# Altium schematic sheet TopLevel.SchDoc
size B; Engineer: Joe H.; DocumentNumber: 000169-501; Revision: 02; SheetNumber: 1; SheetTotal: 1; ProjectTitle: Quick Fire TK USB-C; Reviewer1: Luke C.
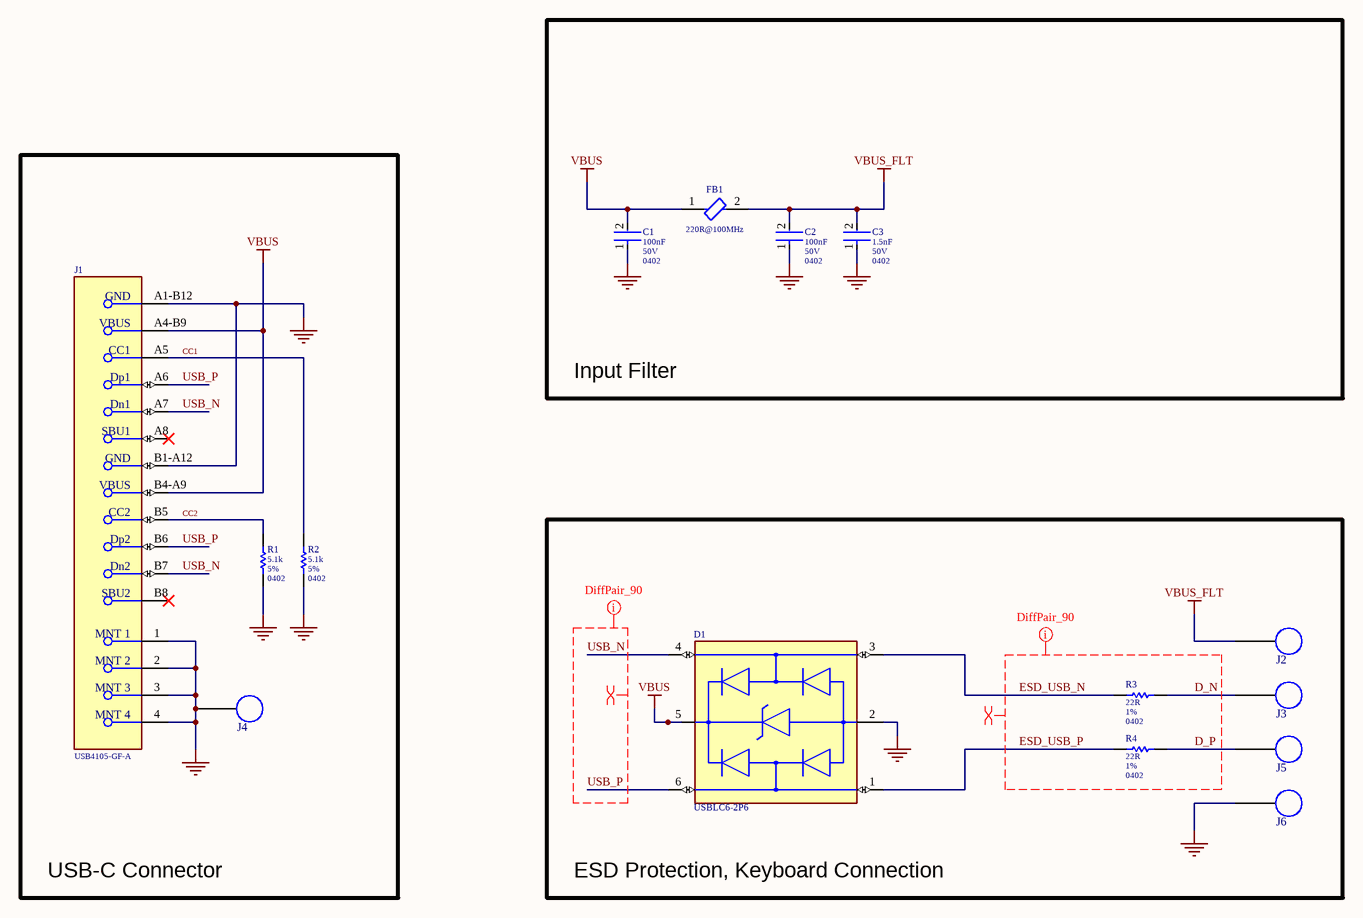
[diagram p0: TopLevel.SchDoc]

## Parts
C1  value 100nF  Voltage: 50V  Footprint: 0402  [FP-GRT155-0_05-IPC_B]  (hidden comment: GRT155R71H104KE01D)
C2  value 100nF  Voltage: 50V  Footprint: 0402  [FP-GRT155-0_05-IPC_B]  (hidden comment: GRT155R71H104KE01D)
C3  value 1.5nF  Voltage: 50V  Footprint: 0402  [FP-GRT155-0_05-IPC_B]  (hidden comment: GRT155R71H152KE01D)
D1  USBLC6-2P6  [FP-SOT-666-MFG]
FB1  ESR (Equivalent Series Resistance): 220R@100MHz  [FP-BLM18-0_15-t0_8-IPC_B]  (hidden comment: BLM18PG221SN1D)
J1  USB4105-GF-A  [FP-USB4105-GF-A-MFG]
J2  20AWG_WTB_TH  [20AWG_WTB_TH]  (value not drawn)  (no BOM)
J3  26AWG_WTB_TH  [26AWG_WTB_TH]  (value not drawn)  (no BOM)
J4  20AWG_WTB_TH  [20AWG_WTB_TH]  (value not drawn)  (no BOM)
J5  26AWG_WTB_TH  [26AWG_WTB_TH]  (value not drawn)  (no BOM)
J6  20AWG_WTB_TH  [20AWG_WTB_TH]  (value not drawn)  (no BOM)
R1  value 5.1k  Tolerance: 5%  Footprint: 0402  [RESC1005X40X25NL05T10]  (hidden comment: RC0402JR-075K1L)
R2  value 5.1k  Tolerance: 5%  Footprint: 0402  [RESC1005X40X25NL05T10]  (hidden comment: RC0402JR-075K1L)
R3  value 22R  Tolerance: 1%  Footprint: 0402  [RESC1005X40X25NL05T10]  (hidden comment: RC0402FR-0722RL)
R4  value 22R  Tolerance: 1%  Footprint: 0402  [RESC1005X40X25NL05T10]  (hidden comment: RC0402FR-0722RL)

## Blocks framed on the sheet
Input Filter: C1-C3 FB1
USB-C Connector: J1 J4 R1 R2
ESD Protection, Keyboard Connection: D1 J2 J3 J5 J6 R3 R4

## Nets
GND: C1.1 C2.1 C3.1 D1.2(GND) J1.1(MNT_1) J1.2(MNT_2) J1.3(MNT_3) J1.4(MNT_4) J1.A1-B12(GND) J1.B1-A12(GND) J4.1(PIN) J6.1(PIN) R1.1 R2.1
VBUS: C1.2 D1.5(VBUS) FB1.1 J1.A4-B9(VBUS) J1.B4-A9(VBUS)
VBUS_FLT: C2.2 C3.2 FB1.2 J2.1(PIN)
CC1: J1.A5(CC1) R2.2
CC2: J1.B5(CC2) R1.2
D_N: J3.1(PIN) R3.2
D_P: J5.1(PIN) R4.2
ESD_USB_N: D1.3(I/O2) R3.1
ESD_USB_P: D1.1(I/O1) R4.1
USB_N: D1.4(I/O2) J1.A7(Dn1) J1.B7(Dn2)
USB_P: D1.6(I/O1) J1.A6(Dp1) J1.B6(Dp2)

Not connected (* = marked no-connect by the designer): J1 A8(SBU1)* B8(SBU2)*

## Layout directives
differential pair: D_N, D_P, ESD_USB_N, ESD_USB_P, USB_N, USB_P
net class DP90: D_N, D_P, ESD_USB_N, ESD_USB_P, USB_N, USB_P

## Notes on the sheet
- BIRB INDUSTRIES
- ENGINEER
- REVIEWER
- PROJECT TITLE
- SHEET TITLE
- DATE
- FILE NAME
- PART NUMBER
- REVISION
- SHEET

## Library data of the parts
C1 C2 = CMP-06035-014200-1: Multi-Layer Ceramic Capacitor 100nF 50V X7R ±10% 0402 Paper T/R; Manufacturer: Murata; Tolerance: 10%; Part Number: GRT155R71H104KE01D
C3 = CMP-06035-024210-1: Multi-Layer Ceramic Capacitor 1.5nF 50V X7R ±10% 0402 Paper T/R; Manufacturer: Murata; Tolerance: 10%; Part Number: GRT155R71H152KE01D
D1 = CMP-12225-000058-1: TVS DIODE 5.25V 17V SOT666; Min Breakdown Voltage: 6V; Power Line Protection: Yes; Element Configuration: Dual; Test Current: 1mA; Working Voltage: 5V; Number of Channels: 2; Max Reverse Leakage Current: 150nA; Direction: Unidirectional; Peak Pulse Current: 5A; Number of Elements: 1; Capacitance: 3.5pF; Max Breakdown Voltage: 6V; Height: 0.6mm; Depth: 1.3mm; Contact Plating: Tin; Reverse Breakdown Voltage: 6V; REACH SVHC: No SVHC; Operating Supply Voltage: 5V; Width: 1.3mm; Max Operating Temperature: 125°C; Reverse Standoff Voltage: 5V; ESD Protection: Yes; Package Quantity: 1; Termination: SMD/SMT; Length: 1.7mm; Leakage Current: 150nA; Number of Bidirectional Channels: 2; Case/Package: SOT-666; Min Operating Temperature: -40°C; Number of Pins: 6; Clamping Voltage: 17V; Breakdown Voltage: 6V; Lead Free: Lead Free; Radiation Hardening: No; Packaging: Tape and Reel; Mount: Surface Mount; Polarity: Unidirectional
FB1 = CMP-0686-00569-3: Chip Ferrite Bead, 0603, 220Ω @ 100MHz, 0.1Ω, 25%, 1.4A; Manufacturer Series: BLM18P; Number of Functions: 1; Shielding: Unshielded; Material: Steel; Impedance: 220R; DC Resistance-Max: 100mR; Lead Free: Lead Free; Current Rating: 1.4A; Test Frequency: 100MHz; Package Quantity: 1; REACH SVHC: No SVHC; Series: BLM18P; Number of Circuits: 1; Height: 0.8mm; Number of Pins: 2; Termination: SMD/SMT; Width: 0.8mm; Max DC Current: 1.4A; Depth: 0.8mm; RoHS Compliant: Yes; Case Code (Imperial): 0603; Number of Lines: 1; Length: 1.6mm; Max Current Rating: 1.4A; Case/Package: 0603; DC Current: 1.4A; Max Operating Temperature: 125°C; Weight: 7.1E-05oz; Tolerance: 25%; Radiation Hardening: No; Packaging: Tape and Reel; DC Resistance (DCR): 100mR; Resistance: 100mR; Min Operating Temperature: -55°C; Core Material: Ferrite; Case Code (Metric): 1608
J1 = CMP-245163-000001-1: CONN RCPT USB2.0 TYPEC 5A; Manufacturer: GCT; Voltage Rating: 20V; Is Female: yes; Current Rating: 5/6.25/1.25/0.25A; Number Of Contacts: 16; Conn Orientation: Right Angle; Device Class L1: Connectors; Category: Conn; Lead Free: Yes; RoHS: TRUE; Temperature Range High: +85°C; Digikey Description: CONN RCPT USB2.0 TYPEC 5A; Device Class L3: unset; ComponentLink2Description: Datasheet; Manufacturer Part Number: USB4105-GF-A; Package: 0; Usb Standard: USB 2.0; Device Class L2: USB Connectors; Automotive: No; Temperature Range Low: -40°C; Height: 3.46mm; Temperature: -40°C to +85°C; Contact Material: Gold,Nickel; ComponentLink2URL: https://gct.co/files/drawings/usb4105.pdf; Octopart: https://octopart.com/usb4105-gf-a-gct-106627878
J2 J4 J6 = 20AWG_WTB_TH: 20AWG Wire to Board Through Hole
J3 J5 = 26AWG_WTB_TH: 26AWG Wire to Board Through Hole
R1 R2 = CMP-2002-08025-1: Thick Film Resistors - SMD 5.1 kOhms 62.5mW 0402 5%; Manufacturer: Yageo / Phycomp; Part Number: RC0402JR-075K1L
R3 R4 = CMP-2002-07520-1: Thick Film Resistors 22 Ohms 62.5mW 0402 1%; Manufacturer: Yageo / Phycomp; Part Number: RC0402FR-0722RL